# Altium schematic sheet preamp_chanel1_bright.SchDoc: Bassman Preamp Chanel 1 Bright
size A4; ProjectName: Ultra Bassman 50W
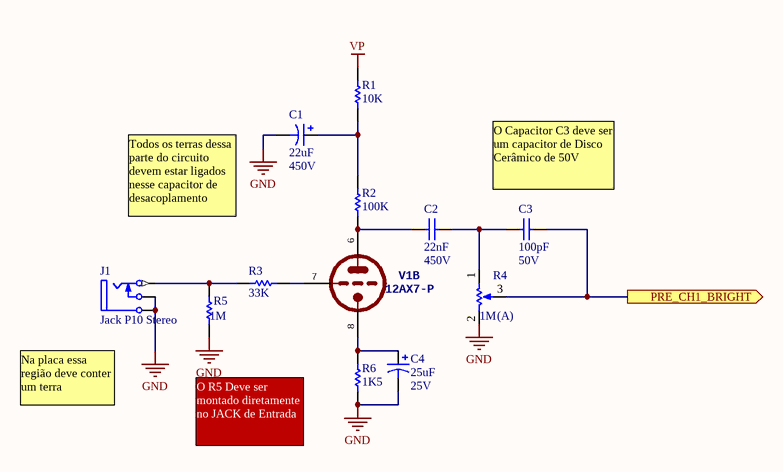
[diagram p0: preamp_chanel1_bright.SchDoc]

## Parts
C1  value 22uF  Voltage: 450V  [RAD-POL-7.6-15]  (hidden comment: Cap Pol Rad)
C2  value 22nF  Voltage: 450V  [ORANGE-DROP-100nF]  (hidden comment: Polyester Film)
C3  value 100pF  Voltage: 50V  [RAD-0.2]  (hidden comment: Ceramic Cap)
C4  value 25uF  Voltage: 25V  [AXIAL-POL-30mm]  (hidden comment: Cap Pol Axial)
J1  Jack P10 Stereo  [JACK-STEREO-3PAD]
R1  value 10K  [AXIAL-0.6]  (hidden comment: Metal Film Resistor 1/2W)
R2  value 100K  [AXIAL-0.6]  (hidden comment: Metal Film Resistor 1/2W)
R3  value 33K  [AXIAL-0.6]  (hidden comment: Metal Film Resistor 1/2W)
R4  value 1M  TYPE: (A)  [pot_alpha - 2.54mm]  (hidden comment: ALPHA Potentiometer)
R5  value 1M  [AXIAL-0.6]  (hidden comment: Metal Film Resistor 1/2W)  (mechanical)
R6  value 1K5  [AXIAL-0.6]  (hidden comment: Metal Film Resistor 1/2W)
V1  12AX7-P  [NOVAL]  (part B of 3)

## Ports
PRE_CH1_BRIGHT (out)

## Nets
GND: C1.2 C4.2 J1.2(TN) J1.5(S) R4.2(BOT) R5.1 R6.1
VP: R1.2
PRE_CH1_BRIGHT: C3.2 R4.3(TAP) ; port PRE_CH1_BRIGHT
NetC1_1: C1.1 R1.1 R2.2
NetC2_1: C2.1 R2.1 V1.6(TA)
NetC2_2: C2.2 C3.1 R4.1(TOP)
NetC4_1: C4.1 R6.2 V1.8(TK)
NetJ1_1: J1.1(T) R3.2 R5.2
NetR3_1: R3.1 V1.7(TG)

## Notes on the sheet
- Todos os terras dessa parte do circuito devem estar ligados nesse capacitor de desacoplamento
- (near C3) O Capacitor C3 deve ser um capacitor de Disco Cerâmico de 50V
- (near J1) Na placa essa região deve conter um terra
- O R5 Deve ser montado diretamente no JACK de Entrada

## Library data of the parts
C1 = Cap Pol Rad: Polarized Capacitor (Axial); Published: 8-Jun-2000; LatestRevisionDate: 17-Jul-2002; LatestRevisionNote: Re-released for DXP Platform.; PackageReference: POLAR0.8; Publisher: Altium Limited; PackageDescription: Polarized Capacitor; 2 Leads
C2 = Cap-PFilm: Capacitor; Published: 8-Jun-2000; LatestRevisionDate: 17-Jul-2002; LatestRevisionNote: Re-released for DXP Platform.; PackageReference: RAD-0.3; Publisher: Altium Limited; PackageDescription: Radial Cap, Thru-Hole; 2 Leads; 0.3 in Pin Spacing
C3 = Cap-Ceramic-Small: Capacitor; Published: 8-Jun-2000; LatestRevisionDate: 17-Jul-2002; LatestRevisionNote: Re-released for DXP Platform.; PackageReference: RAD-0.3; Publisher: Altium Limited; PackageDescription: Radial Cap, Thru-Hole; 2 Leads; 0.3 in Pin Spacing
C4 = Cap Pol Axial: Polarized Capacitor Axial; Published: 8-Jun-2000; LatestRevisionDate: 12-Feb-2014; LatestRevisionNote: Re-released for DXP Platform.; PackageReference: POLAR0.8; Publisher: Whitesheep Amps; PackageDescription: Polarized Capacitor; 2 Leads
J1 = Jack P10 Stereo: Jack Socket, 1/4" [6.5mm], Thru-Hole, Vertical, 2-Conductor with Tip closed; PackageDocument: 2003; PCB_Layout: Complies with manufacturer's recommendation.; DrillAndSlotSize: Corresponds to nominal value.; LatestRevisionDate: 15-Jul-2004; LatestRevisionNote: Component Replaced & renamed from "Phonejack".; DatasheetDocument: 2003; PackageReference: S1VS_SNB; Publisher: Altium Limited; ComponentLink1Description: Manufacturer Link; ComponentLink1URL: http://www.cliffuk.co.uk/
R1-R3 R5 R6 = Res Metal Film 1/2W: Semiconductor Resistor; Published: 8-Jun-2000; LatestRevisionDate: 17-Jul-2002; LatestRevisionNote: 12-Fev-2014; PackageReference: AXIAL-0.6; Publisher: Whitesheep Amps; PackageDescription: Axial Device, Thru-Hole; 2 Leads; 0.5 in Pin Spacing; Power: 1/2W
R4 = alpha-pot: Potentiometer; Sim Note: Enter the Resistance value and the set point into parameter fields.; Set Position: 0.5; Published: 8-Jun-2000; LatestRevisionDate: 17-Jul-2002; LatestRevisionNote: Re-released for DXP Platform.; PackageReference: VR5; Publisher: Altium Limited; PackageDescription: Variable Resistor, Thru-Hole; 3 Leads